# Altium schematic sheet RFM69HCW_BOB.SchDoc: RFM69HCW_BOB
size 270 x 207 mm; Date: 2.5.2016 9:29:05; Organization: Y Soft Corporation; Address1: U Knezske Louky 18; Address2: Praha 3; Address3: 13000; Address4: Czech Republic; SheetNumber: 1
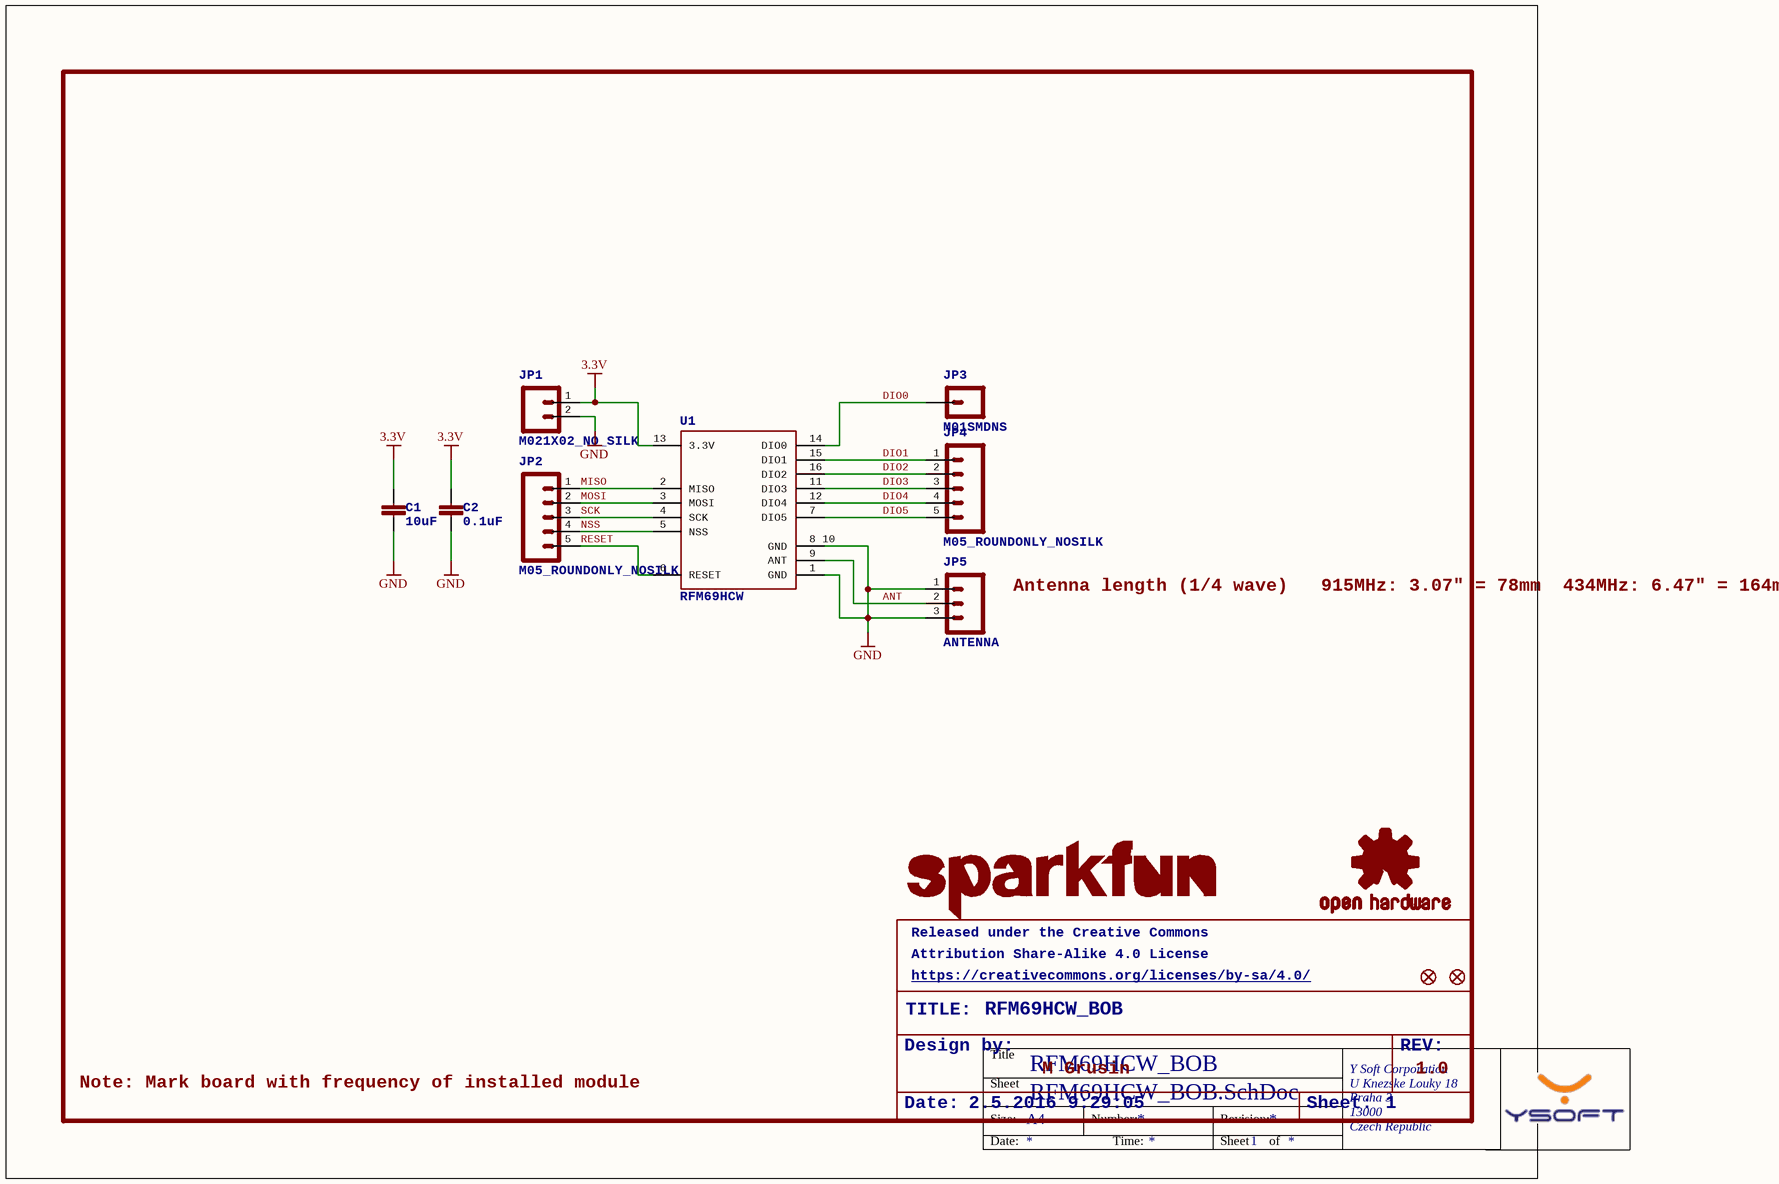
[diagram p0: RFM69HCW_BOB.SchDoc]

## Parts
C1  10uF  [1210]
C2  0.1uF  [0603-CAP]
FID1  FIDUCIAL1X2  [FIDUCIAL-1X2]  (value not drawn)
FID2  FIDUCIAL1X2  [FIDUCIAL-1X2]  (value not drawn)
JP1  M021X02_NO_SILK  [1X02_NO_SILK]
JP2  M05_ROUNDONLY_NOSILK  [1X05_ROUNDONLY_NOSILK]
JP3  M01SMDNS  [1X01NS]
JP4  M05_ROUNDONLY_NOSILK  [1X05_ROUNDONLY_NOSILK]
JP5  ANTENNA  [1X03_ROUND_ONLY_NO_SILK]
LOGO1  SFE_LOGO_NAME.1_INCH  [SFE_LOGO_NAME_.1]  (value not drawn)
LOGO2  OSHW-LOGOS  [OSHW-LOGO-S]  (value not drawn)
U1  RFM69HCW  [RFM69HCW-XXXS2]

## Nets
3.3V: C1.1 C2.1 JP1.1 U1.13(3.3V)
GND: C1.2 C2.2 JP1.2 JP5.1 JP5.3 U1.1(GND) U1.8_10(GND)
ANT: JP5.2 U1.9(ANT)
DIO0: JP3.1 U1.14(DIO0)
DIO1: JP4.1 U1.15(DIO1)
DIO2: JP4.2 U1.16(DIO2)
DIO3: JP4.3 U1.11(DIO3)
DIO4: JP4.4 U1.12(DIO4)
DIO5: JP4.5 U1.7(DIO5)
MISO: JP2.1 U1.2(MISO)
MOSI: JP2.2 U1.3(MOSI)
NSS: JP2.4 U1.5(NSS)
RESET: JP2.5 U1.6(RESET)
SCK: JP2.3 U1.4(SCK)

## Notes on the sheet
- Antenna length (1/4 wave)
  915MHz: 3.07" = 78mm
  434MHz: 6.47" = 164mm
- (near LOGO1) Released under the Creative Commons
- (near LOGO1) Attribution Share-Alike 4.0 License
- (near LOGO1) https://creativecommons.org/licenses/by-sa/4.0/
- Design by:
- TITLE:
- RFM69HCW_BOB
- REV:
- Note: Mark board with frequency of installed module
- Date:
- 2.5.2016 9:29:05
- M Grusin
- Sheet:
- 1
- 1.0
- Title
- Size:
- Sheet
- A4
- Number:
- Revision:
- Time:
- of

## Library data of the parts
C1 = 10UF50V20%(1210): CAP-09824; PROD_ID: CAP-09824; VALUE: 10uF
C2 = 0.1UF-25V(+80/-20%)(0603): CAP-00810 Ceramic Standard decoupling cap; PROD_ID: CAP-00810; VALUE: 0.1uF
FID1 FID2 = FIDUCIAL1X2: Fiducial Alignment PointsVarious fiducial points for machine vision alignment.
JP1 = M021X02_NO_SILK: Header 2Standard 2-pin 0.1" header. Use with straight break away headers (SKU : PRT-00116), right angle break away headers (PRT-00553), swiss pins (PRT-00743), machine pins (PRT-00117), and female headers (PRT-00115). Molex polarized connector foot print use with SKU : PRT-08233 with associated crimp pins and housings.
JP2 JP4 = M05_ROUNDONLY_NOSILK: Header 5Standard 5-pin 0.1" header. Use with straight break away headers (SKU : PRT-00116), right angle break away headers (PRT-00553), swiss pins (PRT-00743), machine pins (PRT-00117), and female headers (PRT-00115). Molex polarized connector foot print use with SKU : PRT-08230 with associated crimp pins and housings.
JP3 = M01SMDNS: Header 1Standard 1-pin 0.1" header. Use with straight break away headers (SKU : PRT-00116), right angle break away headers (PRT-00553), swiss pins (PRT-00743), machine pins (PRT-00117), and female headers (PRT-00115).
JP5 = M03_ROUND_ONLY_NO_SILK: Header 3Standard 3-pin 0.1" header. Use with straight break away headers (SKU : PRT-00116), right angle break away headers (PRT-00553), swiss pins (PRT-00743), machine pins (PRT-00117), and female headers (PRT-00115). Molex polarized connector foot print use with SKU : PRT-08232 with associated crimp pins and housings.
LOGO1 = SFE_LOGO_NAME.1_INCH: SFE Logo, name only    This is the SparkFun name logo. The logo on the schematic will always be the same size; the package variant is the height of the flame part of the logo (or the height the flame would be, if it were drawn). Default layer for the logo on the board is tSilk.
LOGO2 = OSHW-LOGOS: Open Source Hardware Logo This logo indicates the piece of hardware it is found on incorporates a OSHW license and/or adheres to the definition of open source hardware found here: http://freedomdefined.org/OSHW